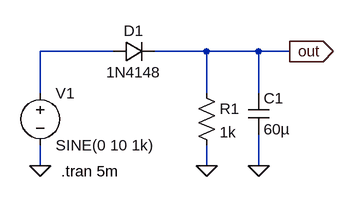
[diagram p0: schematic Half_Rectifier.asc]
Half_Rectifier.asc, the LTspice schematic file:
Version 4
SHEET 1 880 680
WIRE 208 48 96 48
WIRE 352 48 272 48
WIRE 432 48 352 48
WIRE 480 48 432 48
WIRE 96 112 96 48
WIRE 352 112 352 48
WIRE 432 112 432 48
WIRE 96 224 96 192
WIRE 352 224 352 192
WIRE 432 224 432 176
FLAG 352 224 0
FLAG 96 224 0
FLAG 432 224 0
FLAG 480 48 out
IOPIN 480 48 Out
SYMBOL voltage 96 96 R0
WINDOW 123 0 0 Left 0
WINDOW 39 0 0 Left 0
SYMATTR InstName V1
SYMATTR Value SINE(0 10 1k)
SYMBOL diode 208 64 R270
WINDOW 0 32 32 VTop 2
WINDOW 3 0 32 VBottom 2
SYMATTR InstName D1
SYMATTR Value 1N4148
SYMBOL res 336 96 R0
SYMATTR InstName R1
SYMATTR Value 1k
SYMBOL cap 416 112 R0
SYMATTR InstName C1
SYMATTR Value 60µ
TEXT 128 232 Left 2 !.tran 5m

The netlist it stands for:
* Half_Rectifier.asc
V1 N001 0 SINE(0 10 1k)
D1 N001 out 1N4148
R1 out 0 1k
C1 out 0 60µ
.model D D
.lib standard.dio
.tran 5m
.backanno
.end